# Altium schematic sheet POWER_TREE.SchDoc
size A4; SheetNumber: 4; SheetTotal: 12
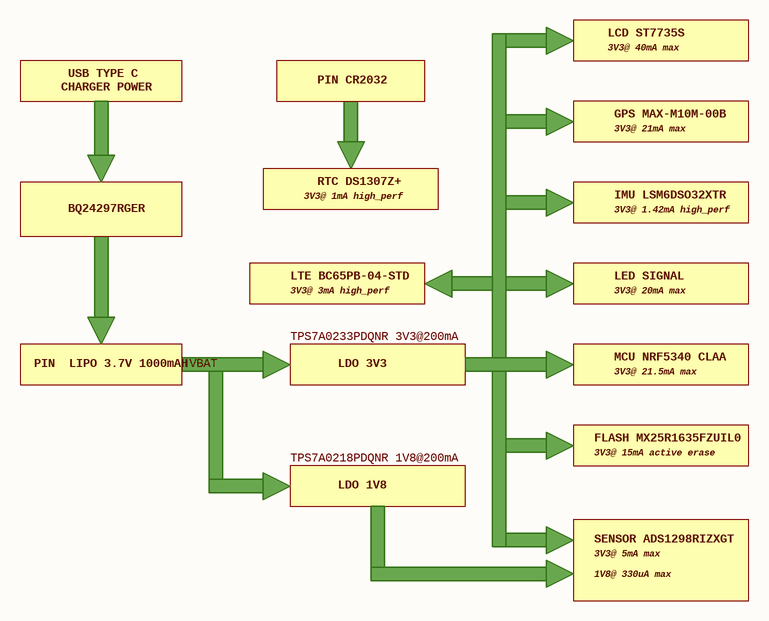
[diagram p0: POWER_TREE.SchDoc]

## Notes on the sheet
- LCD ST7735S
- 3V3@ 40mA max
- CHARGER POWER
- USB TYPE C
- PIN CR2032
- RTC DS1307Z+
- GPS MAX-M10M-00B
- 3V3@ 21mA max
- BQ24297RGER
- 3V3@ 1mA high_perf
- IMU LSM6DSO32XTR
- 3V3@ 1.42mA high_perf
- LTE BC65PB-04-STD
- 3V3@ 3mA high_perf
- LED SIGNAL
- 3V3@ 20mA max
- PIN  LIPO 3.7V 1000mAH
- VBAT
- TPS7A0233PDQNR 3V3@200mA
- LDO 3V3
- MCU NRF5340 CLAA
- 3V3@ 21.5mA max
- FLASH MX25R1635FZUIL0
- 3V3@ 15mA active erase
- TPS7A0218PDQNR 1V8@200mA
- LDO 1V8
- SENSOR ADS1298RIZXGT
- 3V3@ 5mA max
- 1V8@ 330uA max